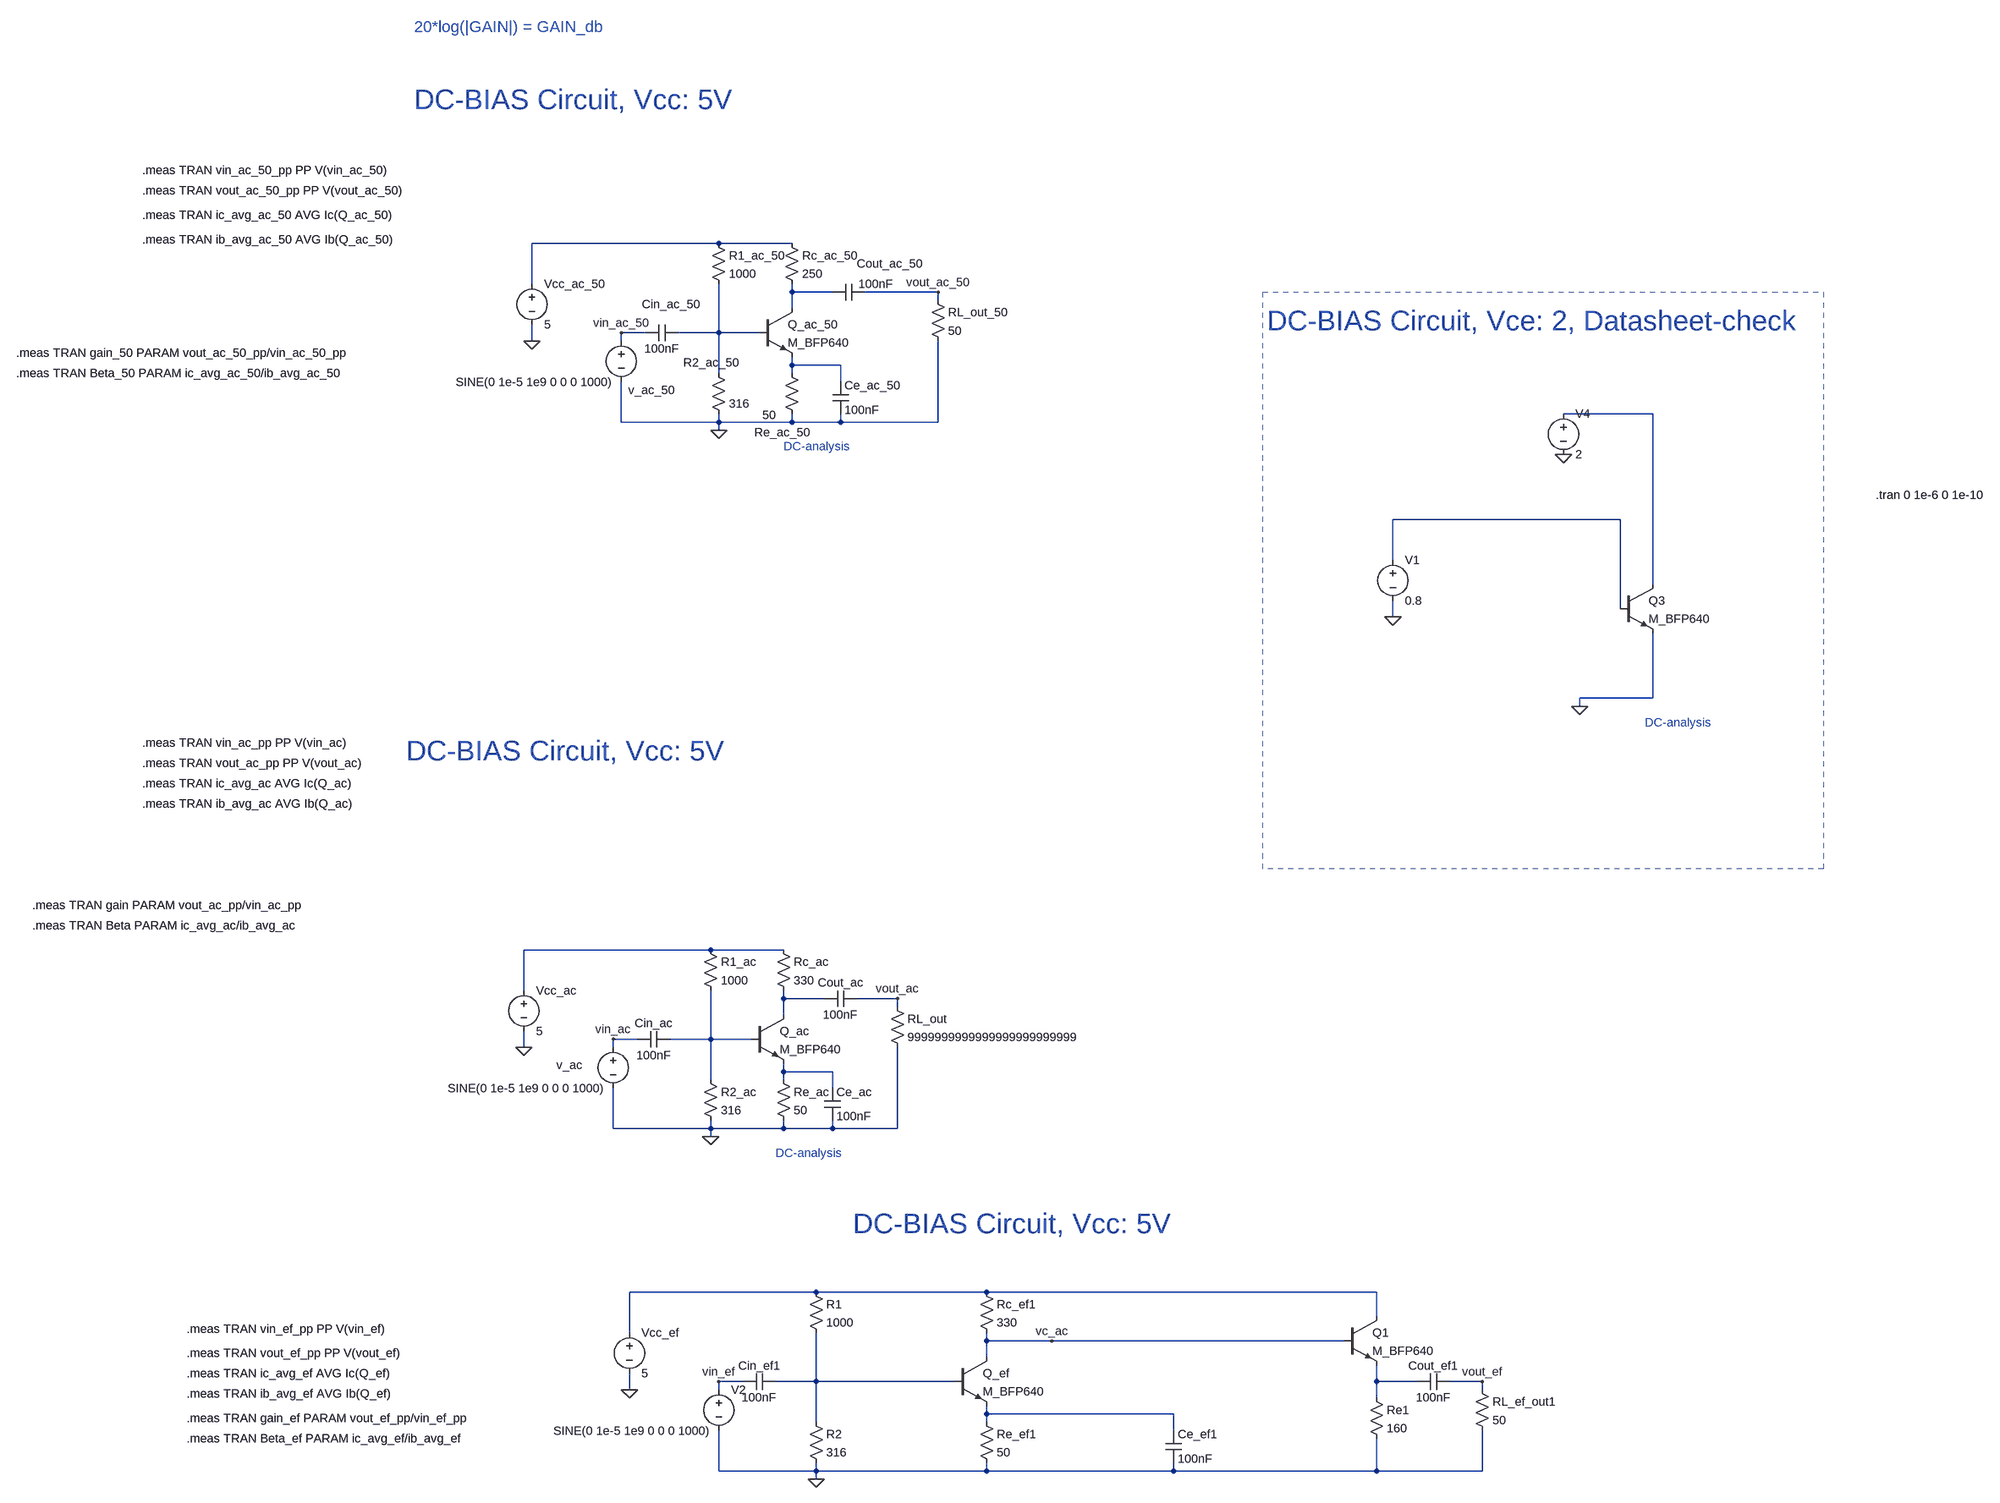
[diagram p0: schematic BP640_AC_5V.asc]
BP640_AC_5V.asc, the LTspice schematic file:
Version 4
SHEET 1 2320 2740
WIRE -1344 -48 -1712 -48
WIRE -1200 -48 -1344 -48
WIRE -1712 32 -1712 -48
WIRE -1200 48 -1200 32
WIRE -1120 48 -1200 48
WIRE -912 48 -1056 48
WIRE -912 64 -912 48
WIRE -1200 80 -1200 48
WIRE -1488 128 -1536 128
WIRE -1344 128 -1344 32
WIRE -1344 128 -1424 128
WIRE -1264 128 -1344 128
WIRE -1712 144 -1712 112
WIRE -1536 144 -1536 128
WIRE -1200 192 -1200 176
WIRE -1104 192 -1200 192
WIRE -1344 208 -1344 128
WIRE -1200 208 -1200 192
WIRE -1104 224 -1104 192
WIRE 496 288 320 288
WIRE -1536 304 -1536 224
WIRE -1344 304 -1344 288
WIRE -1344 304 -1536 304
WIRE -1200 304 -1200 288
WIRE -1200 304 -1344 304
WIRE -1104 304 -1104 288
WIRE -1104 304 -1200 304
WIRE -912 304 -912 144
WIRE -912 304 -1104 304
WIRE -1344 320 -1344 304
WIRE 432 496 -16 496
WIRE -16 576 -16 496
WIRE 496 624 496 288
WIRE 432 672 432 496
WIRE -16 688 -16 656
WIRE 496 848 496 720
WIRE 496 848 352 848
WIRE 352 864 352 848
WIRE -1360 1344 -1728 1344
WIRE -1216 1344 -1360 1344
WIRE -1728 1424 -1728 1344
WIRE -1216 1440 -1216 1424
WIRE -1136 1440 -1216 1440
WIRE -992 1440 -1072 1440
WIRE -992 1456 -992 1440
WIRE -1216 1472 -1216 1440
WIRE -1504 1520 -1552 1520
WIRE -1360 1520 -1360 1424
WIRE -1360 1520 -1440 1520
WIRE -1280 1520 -1360 1520
WIRE -1728 1536 -1728 1504
WIRE -1552 1536 -1552 1520
WIRE -1216 1584 -1216 1568
WIRE -1120 1584 -1216 1584
WIRE -1360 1600 -1360 1520
WIRE -1216 1600 -1216 1584
WIRE -1120 1616 -1120 1584
WIRE -1552 1696 -1552 1616
WIRE -1360 1696 -1360 1680
WIRE -1360 1696 -1552 1696
WIRE -1216 1696 -1216 1680
WIRE -1216 1696 -1360 1696
WIRE -1120 1696 -1120 1680
WIRE -1120 1696 -1216 1696
WIRE -992 1696 -992 1536
WIRE -992 1696 -1120 1696
WIRE -1360 1712 -1360 1696
WIRE -1152 2352 -1520 2352
WIRE -816 2352 -1152 2352
WIRE -48 2352 -816 2352
WIRE -48 2400 -48 2352
WIRE -1520 2432 -1520 2352
WIRE -816 2448 -816 2432
WIRE -688 2448 -816 2448
WIRE -112 2448 -688 2448
WIRE -816 2480 -816 2448
WIRE -1296 2528 -1344 2528
WIRE -1152 2528 -1152 2432
WIRE -1152 2528 -1232 2528
WIRE -880 2528 -1152 2528
WIRE -48 2528 -48 2496
WIRE 32 2528 -48 2528
WIRE 160 2528 96 2528
WIRE -1520 2544 -1520 2512
WIRE -1344 2544 -1344 2528
WIRE 160 2544 160 2528
WIRE -48 2560 -48 2528
WIRE -816 2592 -816 2576
WIRE -448 2592 -816 2592
WIRE -1152 2608 -1152 2528
WIRE -816 2608 -816 2592
WIRE -448 2624 -448 2592
WIRE -1344 2704 -1344 2624
WIRE -1152 2704 -1152 2688
WIRE -1152 2704 -1344 2704
WIRE -816 2704 -816 2688
WIRE -816 2704 -1152 2704
WIRE -448 2704 -448 2688
WIRE -448 2704 -816 2704
WIRE -48 2704 -48 2640
WIRE -48 2704 -448 2704
WIRE 160 2704 160 2624
WIRE 160 2704 -48 2704
WIRE -1152 2720 -1152 2704
FLAG -1728 1536 0
FLAG -1360 1712 0
FLAG -16 688 0
FLAG 352 864 0
FLAG 320 368 0
FLAG -1712 144 0
FLAG -1344 320 0
FLAG -1552 1520 vin_ac
FLAG -1536 128 vin_ac_50
FLAG -912 48 vout_ac_50
FLAG -992 1440 vout_ac
FLAG -1520 2544 0
FLAG -1152 2720 0
FLAG -1344 2528 vin_ef
FLAG 160 2528 vout_ef
FLAG -688 2448 vc_ac
SYMBOL voltage -1728 1408 R0
WINDOW 123 0 0 Left 0
WINDOW 39 0 0 Left 0
SYMATTR InstName Vcc_ac
SYMATTR Value 5
SYMBOL npn -1280 1472 R0
SYMATTR InstName Q_ac
SYMATTR Value M_BFP640
SYMBOL res -1376 1328 R0
SYMATTR InstName R1_ac
SYMATTR Value 1000
SYMBOL res -1376 1584 R0
SYMATTR InstName R2_ac
SYMATTR Value 316
SYMBOL res -1232 1584 R0
SYMATTR InstName Re_ac
SYMATTR Value 50
SYMBOL res -1232 1328 R0
SYMATTR InstName Rc_ac
SYMATTR Value 330
SYMBOL voltage -16 560 R0
WINDOW 123 0 0 Left 0
WINDOW 39 0 0 Left 0
SYMATTR InstName V1
SYMATTR Value 0.8
SYMBOL npn 432 624 R0
SYMATTR InstName Q3
SYMATTR Value M_BFP640
SYMBOL voltage 320 272 R0
WINDOW 123 0 0 Left 0
WINDOW 39 0 0 Left 0
SYMATTR InstName V4
SYMATTR Value 2
SYMBOL res -1008 1440 R0
SYMATTR InstName RL_out
SYMATTR Value 9999999999999999999999999
SYMBOL cap -1136 1616 R0
SYMATTR InstName Ce_ac
SYMATTR Value 100nF
SYMBOL cap -1072 1424 R90
WINDOW 0 0 32 VBottom 2
WINDOW 3 32 32 VTop 2
SYMATTR InstName Cout_ac
SYMATTR Value 100nF
SYMBOL cap -1440 1504 R90
WINDOW 0 0 32 VBottom 2
WINDOW 3 32 32 VTop 2
SYMATTR InstName Cin_ac
SYMATTR Value 100nF
SYMBOL voltage -1552 1520 R0
WINDOW 3 -326 97 Left 2
WINDOW 123 0 0 Left 0
WINDOW 39 0 0 Left 0
WINDOW 0 -112 51 Left 2
SYMATTR Value SINE(0 1e-5 1e9 0 0 0 1000)
SYMATTR InstName v_ac
SYMBOL voltage -1712 16 R0
WINDOW 123 0 0 Left 0
WINDOW 39 0 0 Left 0
SYMATTR InstName Vcc_ac_50
SYMATTR Value 5
SYMBOL npn -1264 80 R0
SYMATTR InstName Q_ac_50
SYMATTR Value M_BFP640
SYMBOL res -1360 -64 R0
SYMATTR InstName R1_ac_50
SYMATTR Value 1000
SYMBOL res -1360 192 R0
WINDOW 0 -54 -5 Left 2
SYMATTR InstName R2_ac_50
SYMATTR Value 316
SYMBOL res -1216 192 R0
WINDOW 0 -58 132 Left 2
WINDOW 3 -42 98 Left 2
SYMATTR InstName Re_ac_50
SYMATTR Value 50
SYMBOL res -1216 -64 R0
SYMATTR InstName Rc_ac_50
SYMATTR Value 250
SYMBOL res -928 48 R0
SYMATTR InstName RL_out_50
SYMATTR Value 50
SYMBOL cap -1120 224 R0
SYMATTR InstName Ce_ac_50
SYMATTR Value 100nF
SYMBOL cap -1056 32 R90
WINDOW 0 -25 -49 VBottom 2
WINDOW 3 -16 -22 VTop 2
SYMATTR InstName Cout_ac_50
SYMATTR Value 100nF
SYMBOL cap -1424 112 R90
WINDOW 0 -25 14 VBottom 2
WINDOW 3 32 32 VTop 2
SYMATTR InstName Cin_ac_50
SYMATTR Value 100nF
SYMBOL voltage -1536 128 R0
WINDOW 0 14 113 Left 2
WINDOW 3 -326 97 Left 2
WINDOW 123 0 0 Left 0
WINDOW 39 0 0 Left 0
SYMATTR InstName v_ac_50
SYMATTR Value SINE(0 1e-5 1e9 0 0 0 1000)
SYMBOL voltage -1520 2416 R0
WINDOW 123 0 0 Left 0
WINDOW 39 0 0 Left 0
SYMATTR InstName Vcc_ef
SYMATTR Value 5
SYMBOL npn -880 2480 R0
SYMATTR InstName Q_ef
SYMATTR Value M_BFP640
SYMBOL res -1168 2336 R0
SYMATTR InstName R1
SYMATTR Value 1000
SYMBOL res -1168 2592 R0
SYMATTR InstName R2
SYMATTR Value 316
SYMBOL res -832 2592 R0
SYMATTR InstName Re_ef1
SYMATTR Value 50
SYMBOL res -832 2336 R0
SYMATTR InstName Rc_ef1
SYMATTR Value 330
SYMBOL res 144 2528 R0
SYMATTR InstName RL_ef_out1
SYMATTR Value 50
SYMBOL cap -464 2624 R0
SYMATTR InstName Ce_ef1
SYMATTR Value 100nF
SYMBOL cap 96 2512 R90
WINDOW 0 0 32 VBottom 2
WINDOW 3 32 32 VTop 2
SYMATTR InstName Cout_ef1
SYMATTR Value 100nF
SYMBOL cap -1232 2512 R90
WINDOW 0 0 32 VBottom 2
WINDOW 3 32 32 VTop 2
SYMATTR InstName Cin_ef1
SYMATTR Value 100nF
SYMBOL voltage -1344 2528 R0
WINDOW 3 -326 97 Left 2
WINDOW 123 0 0 Left 0
WINDOW 39 0 0 Left 0
SYMATTR Value SINE(0 1e-5 1e9 0 0 0 1000)
SYMATTR InstName V2
SYMBOL npn -112 2400 R0
SYMATTR InstName Q1
SYMATTR Value M_BFP640
SYMBOL res -64 2544 R0
SYMATTR InstName Re1
SYMATTR Value 160
TEXT -1232 1744 Left 2 ;DC-analysis
TEXT 1160 448 Left 2 !.tran 0 1e-6 0 1e-10
TEXT -1960 952 Left 5 ;DC-BIAS Circuit, Vcc: 5V
TEXT 480 896 Left 2 ;DC-analysis
TEXT -264 104 Left 5 ;DC-BIAS Circuit, Vce: 2, Datasheet-check
TEXT -1216 352 Left 2 ;DC-analysis
TEXT -1944 -440 Left 5 ;DC-BIAS Circuit, Vcc: 5V
TEXT -1944 -680 Left 3 ;20*log(|GAIN|) = GAIN_db
TEXT -2480 -192 Left 2 !.meas TRAN vin_ac_50_pp PP V(vin_ac_50)
TEXT -2480 -152 Left 2 !.meas TRAN vout_ac_50_pp PP V(vout_ac_50)
TEXT -2480 936 Left 2 !.meas TRAN vin_ac_pp PP V(vin_ac)
TEXT -2480 976 Left 2 !.meas TRAN vout_ac_pp PP V(vout_ac)
TEXT -2480 -104 Left 2 !.meas TRAN ic_avg_ac_50 AVG Ic(Q_ac_50)
TEXT -2480 -56 Left 2 !.meas TRAN ib_avg_ac_50 AVG Ib(Q_ac_50)
TEXT -2480 1016 Left 2 !.meas TRAN ic_avg_ac AVG Ic(Q_ac)
TEXT -2480 1056 Left 2 !.meas TRAN ib_avg_ac AVG Ib(Q_ac)
TEXT -2728 168 Left 2 !.meas TRAN gain_50 PARAM vout_ac_50_pp/vin_ac_50_pp
TEXT -2728 208 Left 2 !.meas TRAN Beta_50 PARAM ic_avg_ac_50/ib_avg_ac_50
TEXT -2696 1256 Left 2 !.meas TRAN gain PARAM vout_ac_pp/vin_ac_pp
TEXT -2696 1296 Left 2 !.meas TRAN Beta PARAM ic_avg_ac/ib_avg_ac
TEXT -1080 2080 Left 5 ;DC-BIAS Circuit, Vcc: 5V
TEXT -2392 2424 Left 2 !.meas TRAN vin_ef_pp PP V(vin_ef)
TEXT -2392 2472 Left 2 !.meas TRAN vout_ef_pp PP V(vout_ef)
TEXT -2392 2512 Left 2 !.meas TRAN ic_avg_ef AVG Ic(Q_ef)
TEXT -2392 2552 Left 2 !.meas TRAN ib_avg_ef AVG Ib(Q_ef)
TEXT -2392 2600 Left 2 !.meas TRAN gain_ef PARAM vout_ef_pp/vin_ef_pp
TEXT -2392 2640 Left 2 !.meas TRAN Beta_ef PARAM ic_avg_ef/ib_avg_ef
RECTANGLE Normal 832 1184 -272 48 2

The netlist it stands for:
* BP640_AC_5V.asc
Vcc_ac N007 0 5
Q_ac N008 N009 N010 0 M_BFP640
R1_ac N007 N009 1000
R2_ac N009 0 316
Re_ac N010 0 50
Rc_ac N007 N008 330
V1 N006 0 0.8
Q3 N005 N006 0 0 M_BFP640
V4 N005 0 2
RL_out vout_ac 0 9999999999999999999999999
Ce_ac N010 0 100nF
Cout_ac vout_ac N008 100nF
Cin_ac N009 vin_ac 100nF
v_ac vin_ac 0 SINE(0 1e-5 1e9 0 0 0 1000)
Vcc_ac_50 N001 0 5
Q_ac_50 N002 N003 N004 0 M_BFP640
R1_ac_50 N001 N003 1000
R2_ac_50 N003 0 316
Re_ac_50 N004 0 50
Rc_ac_50 N001 N002 250
RL_out_50 vout_ac_50 0 50
Ce_ac_50 N004 0 100nF
Cout_ac_50 vout_ac_50 N002 100nF
Cin_ac_50 N003 vin_ac_50 100nF
v_ac_50 vin_ac_50 0 SINE(0 1e-5 1e9 0 0 0 1000)
Vcc_ef N011 0 5
Q_ef vc_ac N012 N014 0 M_BFP640
R1 N011 N012 1000
R2 N012 0 316
Re_ef1 N014 0 50
Rc_ef1 N011 vc_ac 330
RL_ef_out1 vout_ef 0 50
Ce_ef1 N014 0 100nF
Cout_ef1 vout_ef N013 100nF
Cin_ef1 N012 vin_ef 100nF
V2 vin_ef 0 SINE(0 1e-5 1e9 0 0 0 1000)
Q1 N011 vc_ac N013 0 M_BFP640
Re1 N013 0 160
.model NPN NPN
.model PNP PNP
.lib standard.bjt
* DC-analysis
.tran 0 1e-6 0 1e-10
* DC-BIAS Circuit, Vcc: 5V
* DC-analysis
* DC-BIAS Circuit, Vce: 2, Datasheet-check
* DC-analysis
* DC-BIAS Circuit, Vcc: 5V
* 20*log(|GAIN|) = GAIN_db
.meas TRAN vin_ac_50_pp PP V(vin_ac_50)
.meas TRAN vout_ac_50_pp PP V(vout_ac_50)
.meas TRAN vin_ac_pp PP V(vin_ac)
.meas TRAN vout_ac_pp PP V(vout_ac)
.meas TRAN ic_avg_ac_50 AVG Ic(Q_ac_50)
.meas TRAN ib_avg_ac_50 AVG Ib(Q_ac_50)
.meas TRAN ic_avg_ac AVG Ic(Q_ac)
.meas TRAN ib_avg_ac AVG Ib(Q_ac)
.meas TRAN gain_50 PARAM vout_ac_50_pp/vin_ac_50_pp
.meas TRAN Beta_50 PARAM ic_avg_ac_50/ib_avg_ac_50
.meas TRAN gain PARAM vout_ac_pp/vin_ac_pp
.meas TRAN Beta PARAM ic_avg_ac/ib_avg_ac
* DC-BIAS Circuit, Vcc: 5V
.meas TRAN vin_ef_pp PP V(vin_ef)
.meas TRAN vout_ef_pp PP V(vout_ef)
.meas TRAN ic_avg_ef AVG Ic(Q_ef)
.meas TRAN ib_avg_ef AVG Ib(Q_ef)
.meas TRAN gain_ef PARAM vout_ef_pp/vin_ef_pp
.meas TRAN Beta_ef PARAM ic_avg_ef/ib_avg_ef
.backanno
.end